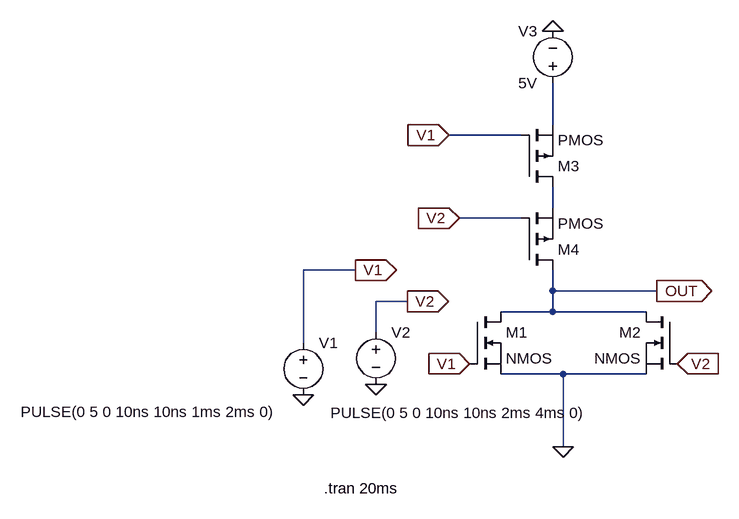
[diagram p0: schematic PorteNOR.asc]
PorteNOR.asc, the LTspice schematic file:
Version 4
SHEET 1 880 680
WIRE 288 0 288 -64
WIRE 240 16 128 16
WIRE 288 128 288 96
WIRE 240 144 144 144
WIRE -16 224 -96 224
WIRE 288 256 288 224
WIRE 448 256 288 256
WIRE 64 272 16 272
WIRE 288 288 288 256
WIRE 288 288 208 288
WIRE 432 288 288 288
WIRE 16 320 16 272
WIRE -96 336 -96 224
WIRE 304 384 208 384
WIRE 432 384 304 384
WIRE 304 496 304 384
FLAG 288 -144 0
FLAG 304 496 0
FLAG -96 416 0
FLAG 16 400 0
FLAG -16 224 V1
IOPIN -16 224 Out
FLAG 64 272 V2
IOPIN 64 272 Out
FLAG 448 256 OUT
IOPIN 448 256 Out
FLAG 160 368 V1
IOPIN 160 368 In
FLAG 480 368 V2
IOPIN 480 368 In
FLAG 128 16 V1
IOPIN 128 16 In
FLAG 144 144 V2
IOPIN 144 144 In
SYMBOL nmos 160 288 R0
SYMATTR InstName M1
SYMBOL nmos 480 288 M0
SYMATTR InstName M2
SYMBOL pmos 240 96 M180
SYMATTR InstName M3
SYMBOL pmos 240 224 M180
SYMATTR InstName M4
SYMBOL voltage -96 320 R0
WINDOW 3 -435 122 Left 2
WINDOW 123 0 0 Left 0
WINDOW 39 0 0 Left 0
SYMATTR Value PULSE(0 5 0 10ns 10ns 1ms 2ms 0)
SYMATTR InstName V1
SYMBOL voltage 16 304 R0
WINDOW 3 -70 140 Left 2
WINDOW 123 0 0 Left 0
WINDOW 39 0 0 Left 0
SYMATTR Value PULSE(0 5 0 10ns 10ns 2ms 4ms 0)
SYMATTR InstName V2
SYMBOL voltage 288 -48 R180
WINDOW 0 24 96 Left 2
WINDOW 3 24 16 Left 2
WINDOW 123 0 0 Left 0
WINDOW 39 0 0 Left 0
SYMATTR InstName V3
SYMATTR Value 5V
TEXT -64 560 Left 2 !.tran 20ms

The netlist it stands for:
* PorteNOR.asc
M1 OUT V1 0 0 NMOS
M2 OUT V2 0 0 NMOS
M3 N002 V1 N001 N001 PMOS
M4 OUT V2 N002 N002 PMOS
V1 V1 0 PULSE(0 5 0 10ns 10ns 1ms 2ms 0)
V2 V2 0 PULSE(0 5 0 10ns 10ns 2ms 4ms 0)
V3 N001 0 5V
.model NMOS NMOS
.model PMOS PMOS
.lib standard.mos
.tran 20ms
.backanno
.end

* Results of the author's LTspice run, read from the files saved beside the schematic
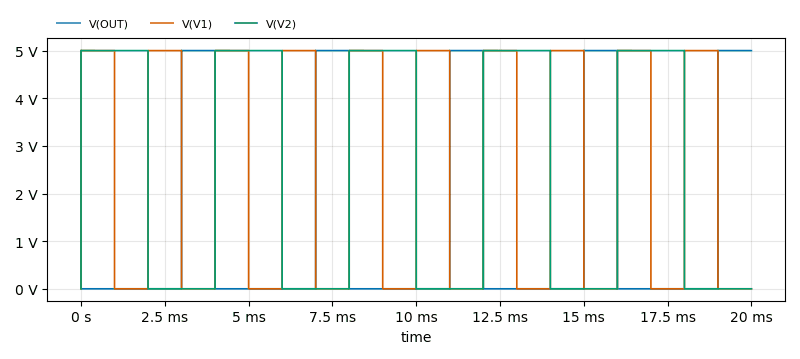
[diagram p1: Transient Analysis of PorteNOR.asc, plotted from the saved traces]
* Transient Analysis, 1 run:
*   V(OUT): min 0 V, max 5.005 V, average 1.25 V, rms 2.5 V, last 5 V
*   V(V1): min 0 V, max 5 V, average 2.5 V, rms 3.536 V, last 0 V
*   V(V2): min 0 V, max 5 V, average 2.5 V, rms 3.536 V, last 0 V